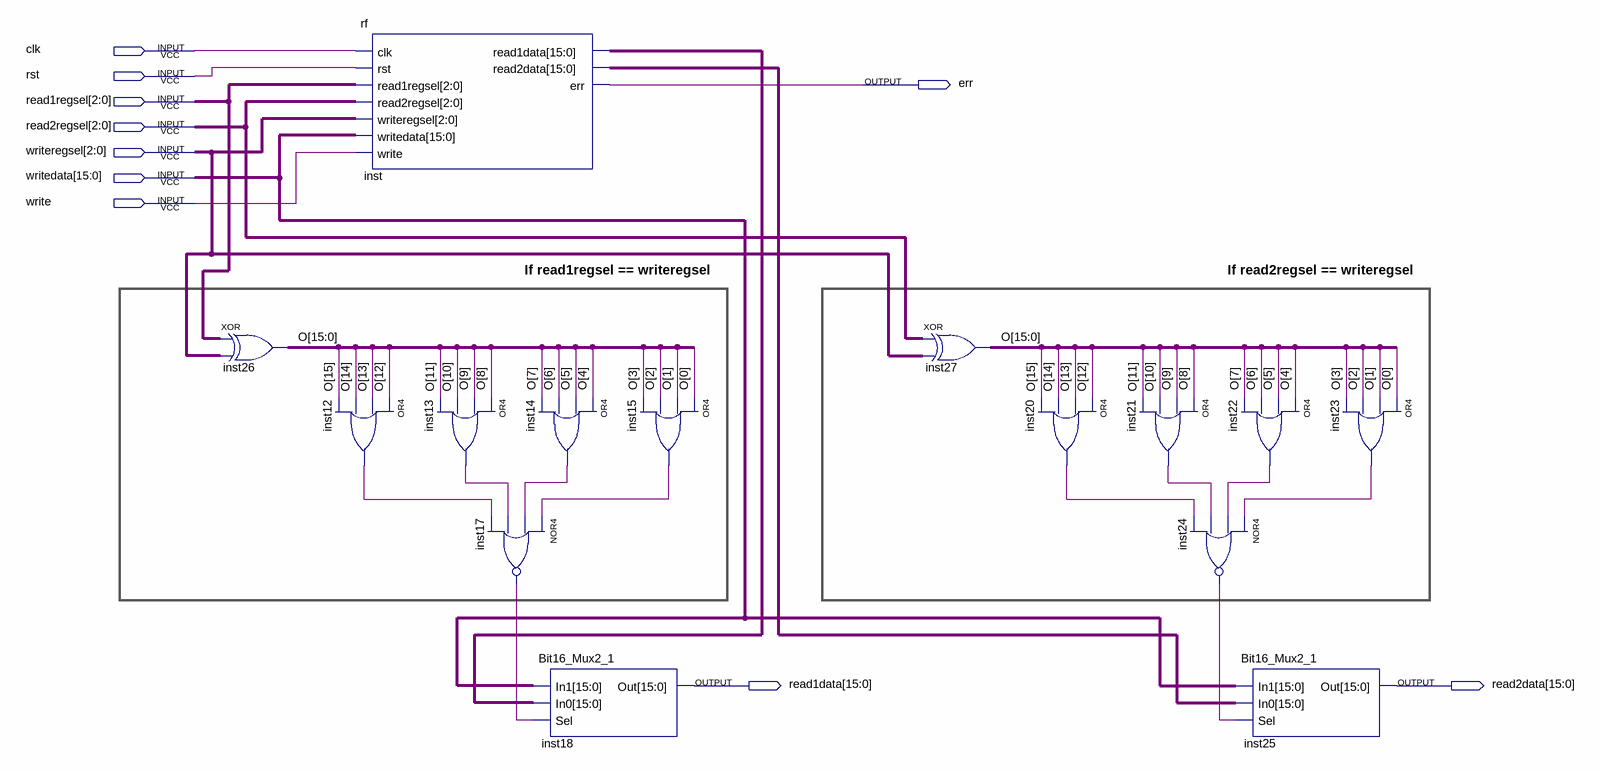
[diagram p0: schematic sheet]
// Quartus schematic rf_bypass.bdf as structural Verilog: 15 symbols, 10 pins
module rf_bypass (
  input  clk,
  input  rst,
  input  [2:0] read1regsel,
  input  [2:0] read2regsel,
  input  [2:0] writeregsel,
  input  [15:0] writedata,
  input  write,
  output err,
  output [15:0] read1data,
  output [15:0] read2data
);

  wire inst12_out, inst13_out, inst14_out, inst15_out, inst17_out, inst20_out, inst21_out, inst22_out,
       inst23_out, inst24_out;
  wire [15:0] inst_read1data, inst_read2data, O;

  assign O = read1regsel ^ writeregsel;  // XOR inst26, 16 bits wide
  rf inst (
    .clk(clk), .rst(rst), .read1regsel(read1regsel), .read2regsel(read2regsel), .writeregsel(writeregsel),
    .writedata(writedata), .write(write), .read1data(inst_read1data), .read2data(inst_read2data), .err(err));
  or inst12 (inst12_out, O[12], O[13], O[14], O[15]);
  or inst13 (inst13_out, O[8], O[9], O[10], O[11]);
  nor inst17 (inst17_out, inst15_out, inst14_out, inst13_out, inst12_out);
  or inst14 (inst14_out, O[4], O[5], O[6], O[7]);
  Bit16_Mux2_1 inst18 (.In1(writedata), .In0(inst_read1data), .Sel(inst17_out), .Out(read1data));
  or inst15 (inst15_out, O[0], O[1], O[2], O[3]);
  assign O = read2regsel ^ writeregsel;  // XOR inst27, 16 bits wide
  or inst20 (inst20_out, O[12], O[13], O[14], O[15]);
  or inst21 (inst21_out, O[8], O[9], O[10], O[11]);
  nor inst24 (inst24_out, inst23_out, inst22_out, inst21_out, inst20_out);
  or inst22 (inst22_out, O[4], O[5], O[6], O[7]);
  Bit16_Mux2_1 inst25 (.In1(writedata), .In0(inst_read2data), .Sel(inst24_out), .Out(read2data));
  or inst23 (inst23_out, O[0], O[1], O[2], O[3]);

  // Notes on the sheet:
  //   If read1regsel == writeregsel
  //   If read2regsel == writeregsel
endmodule
